# EAGLE design EthTInfo (EAGLE 7.7.0)
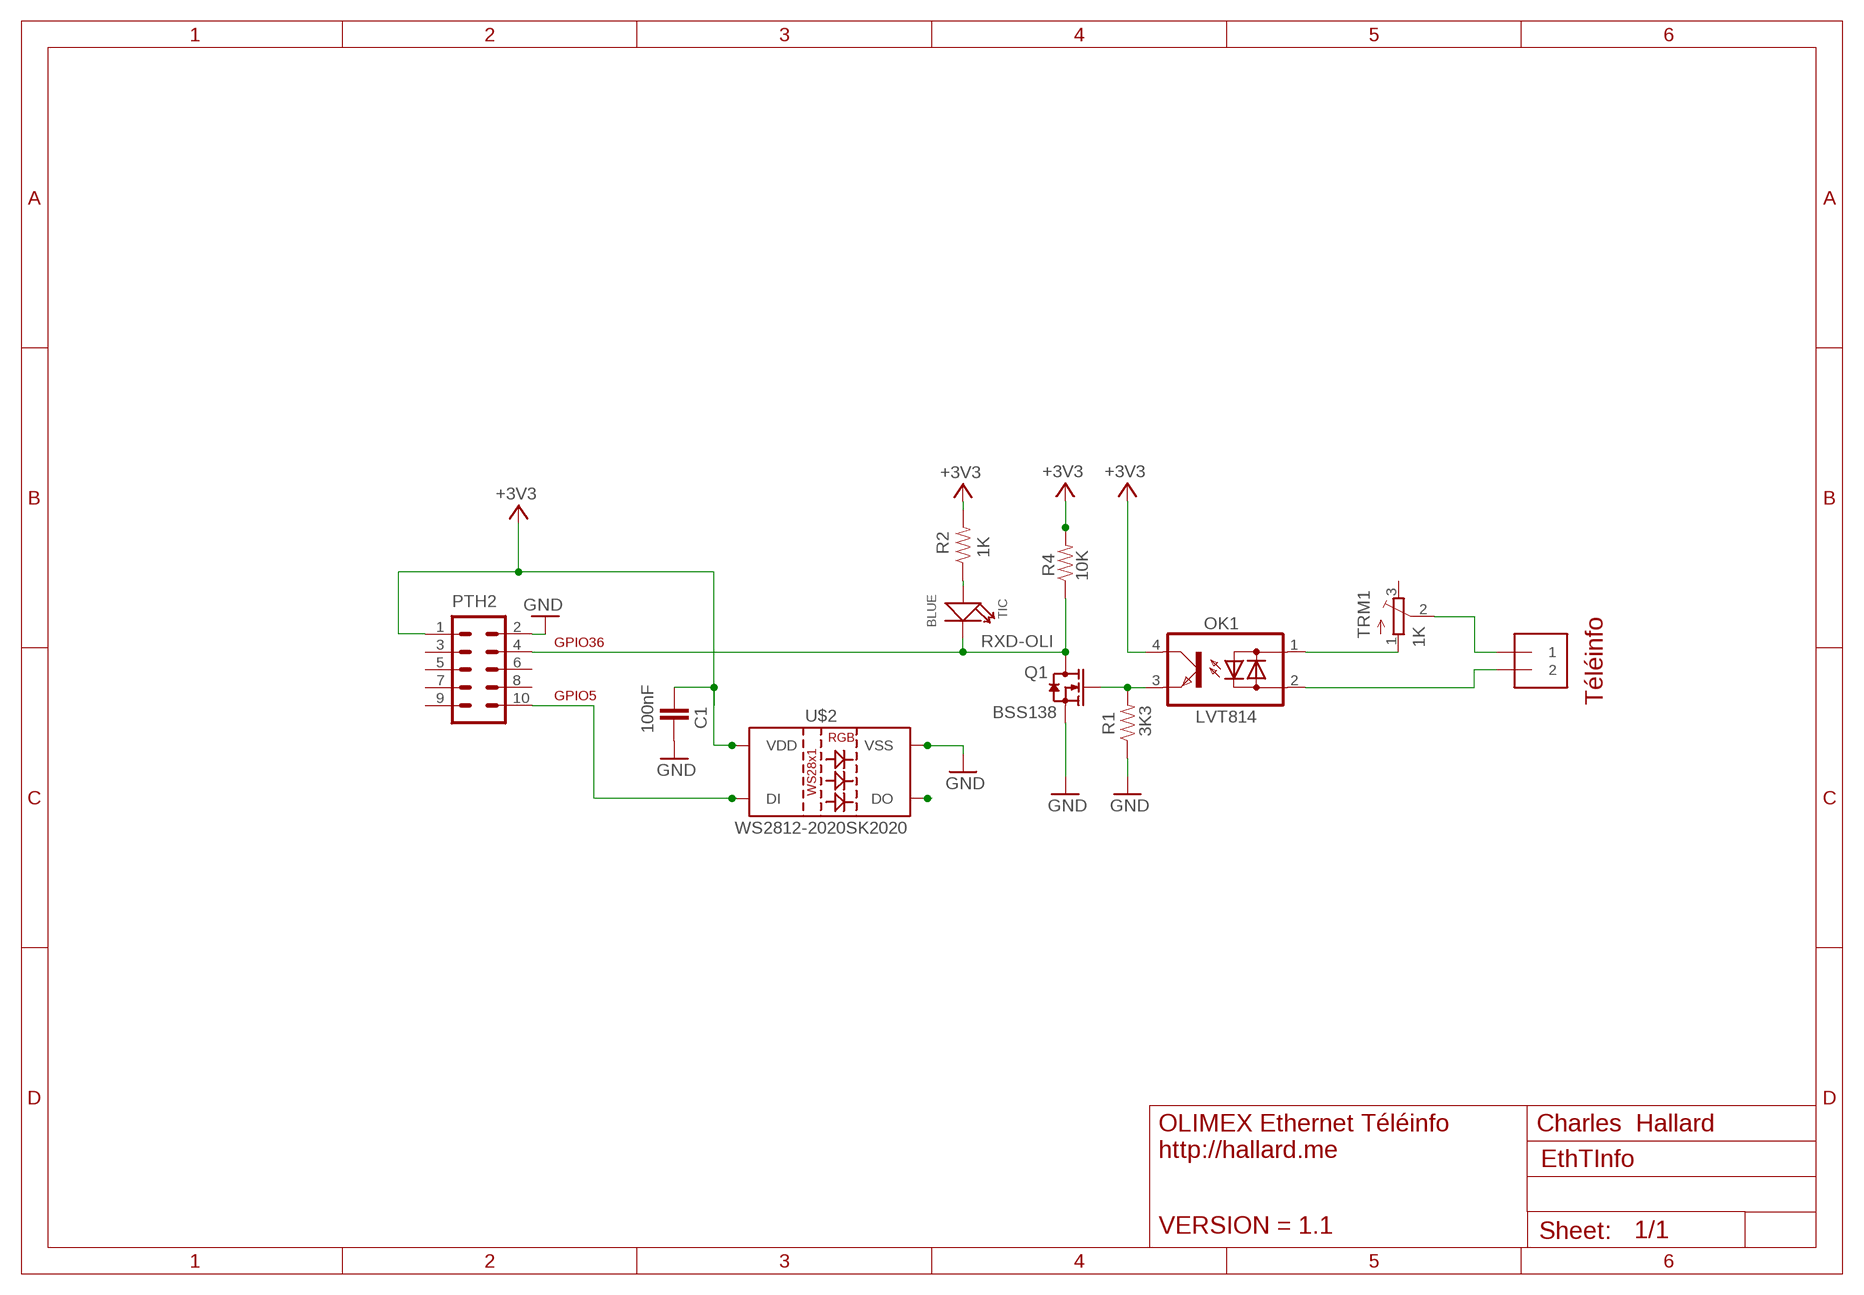
[diagram p0: schematic, sheet 1]
RFPIGW (A4L-LOC): VERSION: 1.1

## Parts
C1  100nF  CAP0402-CAP-OK  [0402-CAP-OK]
J1  1X2-3.5MM-3.5MM  [1X2-3.5MM]
OK1  LVT814  SFH6206  [DIL4-SMD]
PTH2  ML10FEMALE  [ML10-FEMALE]
Q1  BSS138  SMD-MOSFET-N-CH-20V-2.1A-CJ2302(SOT-23)  [SOT-323-3]
R1  3K3  RESISTOR0402-RES  [0402-RES]
R2  1K  RESISTOR0402-RES  [0402-RES]
R4  10K  RESISTOR0402-RES  [0402-RES]
TIC  BLUE  SMD-LED-CLEAR-BLUE(0402)  [LED-0402]
TRM1  1K  TRIMPOTTC33X  [TC33X]
U$2  WS2812-2020SK2020  [SK6805-2020]

## Nets
3V3 [power]: C1.2 OK1.4(C) PTH2.1 R2.2 R4.2 U$2.1(VDD) ; supply symbol labelled +3V3
GND [power]: C1.1 PTH2.2 Q1.2(S) R1.1 U$2.3(VSS)
N$1: OK1.3(E) Q1.1(G) R1.2
N$2: R2.1 TIC.+
N$3: J1.1 TRM1.2(S)
N$4: J1.2 OK1.2(AC2)
N$5: U$2.2(DO)
N$6: PTH2.10 U$2.4(DI)
N$7: OK1.1(AC1) TRM1.1(A)
RXD-OLI: PTH2.4 Q1.3(D) R4.1 TIC.-
Unconnected: PTH2.3 PTH2.5 PTH2.6 PTH2.7 PTH2.8 PTH2.9 TRM1.3(E)

## Notes on the sheet
- GPIO36
- Téléinfo
- GPIO5
- Charles  Hallard
- OLIMEX Ethernet Téléinfo
  http://hallard.me

## Library data of the parts
C1 = _c2h:CAP: Capacitor Standard 0603 ceramic capacitor, and 0.1" leaded capacitor.
J1 = _c2h:1X2-3.5MM: 3.5mm Terminal block http://www.ladyada.net/library/pcb/eaglelibrary.html
OK1 = optocoupler:SFH620: Optocoupler, Phototransistor Output, AC Input Source: http://www.vishay.com/docs/83675/sfh620.pdf; MF: VISHAY/TELEFUNKEN; MPN: SFH6206-3; OC_FARNELL: 1469585; OC_NEWARK: 58K2214
PTH2 = UEXT:ML10: UEXT
Q1 = _c2h:SMD-MOSFET-N-CH-20V-2.1A-CJ2302(SOT-23): 305030015
R1 R2 R4 = _c2h:RESISTOR: Resistor Basic schematic elements and footprints for 0603, 1206, and PTH resistors.
TIC = OPL_Optoelectronics:SMD-LED-CLEAR-BLUE(0402): 304090075; MPN: BL-HB337A-AV-TRB; VALUE: BLUE-0402
TRM1 = adafruit:TRIMPOT: SMT trimmer potentiometer part number TC33X http://www.ladyada.net/library/eagle
U$2 = _c2h:WS2812-2020

## Net classes
0 default: width 0.152 mm, drill 0.356 mm, clearance 0.152 mm
1 power: width 0.203 mm, drill 0.356 mm, clearance 0.152 mm

## Board
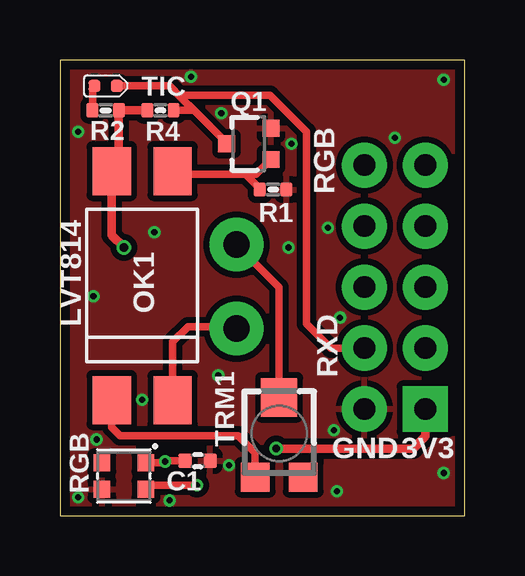
[diagram p1: board, top side]
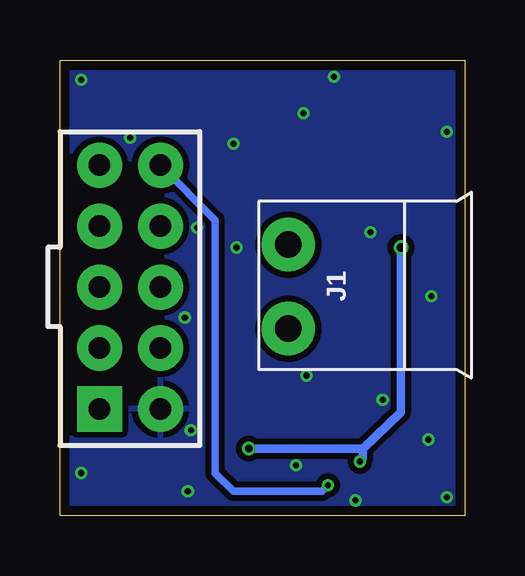
[diagram p2: board, bottom side, seen from below]

Size 16.89 x 18.99 mm. Coordinates in mm from the lower left corner, seen from the top.
Outline: 0,0 16.89,0 16.89,18.99 0,18.99 0,0
Copper layers (1*16): Top 0.035559375mm / dielectric 1.6mm / Bottom 0.035559375mm
Design rules "oshpark-2layer *": minimum track width 6mil, minimum drill 10mil, track to track 6mil, track to pad 6mil, pad to pad 6mil, via to via 6mil, smd to smd 6mil, copper to edge 15mil, drill to drill 6mil, minimum pad ring 5mil, minimum via ring 5mil, stop-mask expansion 2.5mil, vias tented up to drill 30mil, thermal gap 10mil

### Footprints (pad centres in the part's own frame; a part is rotated, then mirrored left to right if it is on the bottom)
0402-CAP-OK = smd 0.56 x 0.6: 1 -0.521,0; 2 0.525,0
1X2-3.5MM = drill 1.1 pad 2.235: 1 1.8,0; 2 -1.7,0
DIL4-SMD = smd 1.6 x 2: 1 -1.27,-4.77; 2 1.27,-4.77; 3 1.27,4.77; 4 -1.27,4.77
ML10-FEMALE = drill 0.9 pad 1.88 square: 1 -5.08,-1.27 | drill 0.9 pad 1.88: 2 -5.08,1.27; 3 -2.54,-1.27; 4 -2.54,1.27; 5 0,-1.27; 6 0,1.27; 7 2.54,-1.27; 8 2.54,1.27; 9 5.08,-1.27; 10 5.08,1.27
SOT-323-3 = smd 0.7 x 0.7: 1 -0.65,-0.925; 2 0.65,-0.925; 3 0,0.925
0402-RES = smd 0.5 x 0.6: 1 -0.55,0; 2 0.55,0
LED-0402 = smd 0.5 x 0.5: + -0.463,0; - 0.463,0
TC33X = smd 1.2 x 1.2: 1 -1,-1.825; 3 1,-1.825 | smd 1.5 x 1.6: 2 0,1.5
SK6805-2020 = smd 0.7 x 0.7: 1 0.915,0.55; 2 -0.915,0.55; 3 -0.915,-0.55; 4 0.915,-0.55

### Placement (x,y rotation side)
C1  5.75,2.29 180 top
J1  7.37,9.49 90 bottom
OK1  3.43,9.59 0 top
PTH2  13.97,9.53 90 top
Q1  7.87,15.49 90 top
R1  8.89,13.59 180 top
R2  1.9,16.89 0 top
R4  4.19,16.89 180 top
TIC  1.9,17.91 0 top
TRM1  9.14,3.43 0 top
U$2  2.67,1.65 0 top

### Tracks (layer width: path | path; a pad name or v marks a point on that pad's centre or on a via)
3V3  (via drill 0.25, 0.3, 0.36)
  Top 0.305: 2.46,14.65 OK1.4 | C1.2 4.41,2.29 v4.38,2.26 4.31,2.2 U$2.1
  Top 0.356: OK1.4 2.16,11.68 v2.67,11.18 | 2.46,14.65 R2.2 R4.2 | v9.02,2.79 14.73,2.79 15.24,3.3 PTH2.1
  Bottom 0.356: v2.67,11.18 2.67,4.32 4.25,2.79 | v9.02,2.79 4.25,2.79 | 4.25,2.79 4.25,2.38 v4.38,2.26
GND  (via drill 0.25)
  other vias: 7.05,2.1 6.73,16.76 11.56,1.02 3.94,11.81 6.6,5.84 9.52,11.18 9.65,15.49 0.76,16 11.68,8.26 1.52,3.17 1.4,9.14 16,1.78 5.46,18.29 16,18.16 13.97,15.75 11.43,3.56 0.76,0.76 4.57,0.63 3.43,4.83 11.18,12
  pour Bottom (isolate 0.254): -0.89,20 18.1,19.94 18.1,-0.63 -0.89,-0.63
  pour Top (isolate 0.254): -0.25,-0.32 17.78,-0.32 17.78,19.62 -0.25,19.69
N$1
  Top 0.305: OK1.3 4.83,14.22 7.75,14.22 | 7.75,14.22 8.18,14.22 Q1.1 | R1.2 8.34,13.63 7.75,14.22
N$2
  Top 0.305: R2.1 1.35,17.82 TIC.+
N$3
  Top 0.305: TRM1.2 9.14,9.52 J1.1
N$4
  Top 0.305: OK1.2 4.7,7.24 5.33,7.87 7.28,7.87 J1.2
N$6  (via drill 0.25)
  Top 0.305: v5.71,1.27 3.81,1.27 3.68,1.14 3.55,1.14 U$2.4
  Bottom 0.305: PTH2.10 10.41,12.32 10.41,1.78 9.65,1.02 5.97,1.02 v5.71,1.27
N$7
  Top 0.305: TRM1.1 8.14,2.62 7.43,3.33 2.51,3.33 2.16,3.68 OK1.1
RXD-OLI
  Top 0.305: TIC.- 4.57,17.91 5.08,17.4 | PTH2.4 11.3,6.98 10.29,8 10.29,16 8.76,17.53 5.21,17.53 5.08,17.4 | Q1.3 6.99,15.49 5.59,16.89 | 5.59,16.89 5.08,17.4 | R4.1 5.59,16.89

### Text on the board
tNames: RGB | RXD | GND | 3V3 | RGB
tStop: EthTInfo | V1.1
bStop: EthTInfo | V1.1